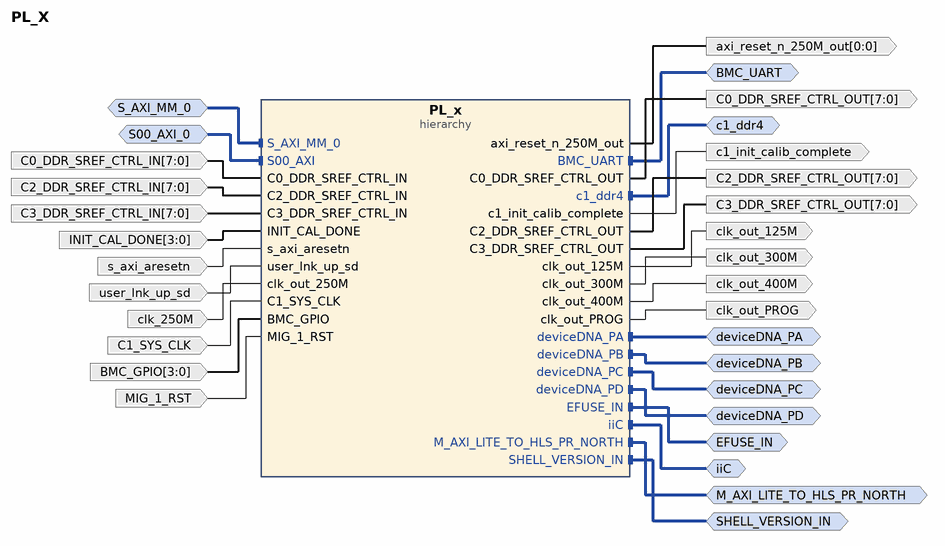
[diagram p0: block diagram of the top level]
# Vivado block design PL_X, xcu200-fsgd2104-2-e, Vivado 2020.1
create_bd_design PL_X

create_bd_intf_port -mode Master -vlnv xilinx.com:interface:gpio_rtl:1.0 EFUSE_IN
create_bd_intf_port -mode Master -vlnv xilinx.com:interface:aximm_rtl:1.0 M_AXI_LITE_TO_HLS_PR_NORTH
set_property -dict [list \
  CONFIG.DATA_WIDTH 32 \
  CONFIG.PROTOCOL AXI4LITE \
  CONFIG.FREQ_HZ 250000000 \
  CONFIG.ADDR_WIDTH 32 \
  CONFIG.HAS_BURST 0 \
  CONFIG.HAS_QOS 0 \
  CONFIG.HAS_REGION 0 \
  CONFIG.NUM_READ_OUTSTANDING 32 \
] [get_bd_intf_ports M_AXI_LITE_TO_HLS_PR_NORTH]
create_bd_intf_port -mode Master -vlnv xilinx.com:interface:gpio_rtl:1.0 SHELL_VERSION_IN
create_bd_intf_port -mode Slave -vlnv xilinx.com:interface:aximm_rtl:1.0 S_AXI_MM_0
set_property -dict [list \
  CONFIG.DATA_WIDTH 512 \
  CONFIG.PROTOCOL AXI4 \
  CONFIG.FREQ_HZ 250000000 \
  CONFIG.ID_WIDTH 6 \
  CONFIG.ADDR_WIDTH 64 \
  CONFIG.AWUSER_WIDTH 0 \
  CONFIG.ARUSER_WIDTH 0 \
  CONFIG.WUSER_WIDTH 0 \
  CONFIG.RUSER_WIDTH 0 \
  CONFIG.BUSER_WIDTH 0 \
  CONFIG.READ_WRITE_MODE READ_WRITE \
  CONFIG.HAS_BURST 1 \
  CONFIG.HAS_LOCK 1 \
  CONFIG.HAS_PROT 1 \
  CONFIG.HAS_CACHE 1 \
  CONFIG.HAS_QOS 1 \
  CONFIG.HAS_REGION 1 \
  CONFIG.HAS_WSTRB 1 \
  CONFIG.HAS_BRESP 1 \
  CONFIG.HAS_RRESP 1 \
  CONFIG.SUPPORTS_NARROW_BURST 0 \
  CONFIG.NUM_READ_OUTSTANDING 32 \
  CONFIG.NUM_WRITE_OUTSTANDING 32 \
  CONFIG.MAX_BURST_LENGTH 256 \
  CONFIG.NUM_READ_THREADS 1 \
  CONFIG.NUM_WRITE_THREADS 1 \
  CONFIG.RUSER_BITS_PER_BYTE 0 \
  CONFIG.WUSER_BITS_PER_BYTE 0 \
] [get_bd_intf_ports S_AXI_MM_0]
create_bd_intf_port -mode Master -vlnv xilinx.com:interface:ddr4_rtl:1.0 c1_ddr4
create_bd_intf_port -mode Master -vlnv xilinx.com:interface:gpio_rtl:1.0 deviceDNA_PA
create_bd_intf_port -mode Master -vlnv xilinx.com:interface:gpio_rtl:1.0 deviceDNA_PB
create_bd_intf_port -mode Master -vlnv xilinx.com:interface:gpio_rtl:1.0 deviceDNA_PC
create_bd_intf_port -mode Master -vlnv xilinx.com:interface:gpio_rtl:1.0 deviceDNA_PD
create_bd_intf_port -mode Slave -vlnv xilinx.com:interface:aximm_rtl:1.0 S00_AXI_0
set_property -dict [list \
  CONFIG.DATA_WIDTH 32 \
  CONFIG.PROTOCOL AXI4LITE \
  CONFIG.FREQ_HZ 250000000 \
  CONFIG.ID_WIDTH 0 \
  CONFIG.ADDR_WIDTH 32 \
  CONFIG.AWUSER_WIDTH 0 \
  CONFIG.ARUSER_WIDTH 0 \
  CONFIG.WUSER_WIDTH 0 \
  CONFIG.RUSER_WIDTH 0 \
  CONFIG.BUSER_WIDTH 0 \
  CONFIG.READ_WRITE_MODE READ_WRITE \
  CONFIG.HAS_BURST 1 \
  CONFIG.HAS_LOCK 1 \
  CONFIG.HAS_PROT 1 \
  CONFIG.HAS_CACHE 1 \
  CONFIG.HAS_QOS 1 \
  CONFIG.HAS_REGION 1 \
  CONFIG.HAS_WSTRB 1 \
  CONFIG.HAS_BRESP 1 \
  CONFIG.HAS_RRESP 1 \
  CONFIG.SUPPORTS_NARROW_BURST 0 \
  CONFIG.NUM_READ_OUTSTANDING 2 \
  CONFIG.NUM_WRITE_OUTSTANDING 2 \
  CONFIG.MAX_BURST_LENGTH 1 \
  CONFIG.NUM_READ_THREADS 1 \
  CONFIG.NUM_WRITE_THREADS 1 \
  CONFIG.RUSER_BITS_PER_BYTE 0 \
  CONFIG.WUSER_BITS_PER_BYTE 0 \
] [get_bd_intf_ports S00_AXI_0]
create_bd_intf_port -mode Master -vlnv xilinx.com:interface:uart_rtl:1.0 BMC_UART
create_bd_intf_port -mode Master -vlnv xilinx.com:interface:iic_rtl:1.0 iiC
create_bd_port -dir I -from 7 -to 0 C0_DDR_SREF_CTRL_IN
create_bd_port -dir O -from 7 -to 0 C0_DDR_SREF_CTRL_OUT
create_bd_port -dir I -from 7 -to 0 C2_DDR_SREF_CTRL_IN
create_bd_port -dir O -from 7 -to 0 C2_DDR_SREF_CTRL_OUT
create_bd_port -dir I -from 7 -to 0 C3_DDR_SREF_CTRL_IN
create_bd_port -dir O -from 7 -to 0 C3_DDR_SREF_CTRL_OUT
create_bd_port -dir I -from 3 -to 0 INIT_CAL_DONE
create_bd_port -dir O -from 0 -to 0 -type rst axi_reset_n_250M_out
create_bd_port -dir O c1_init_calib_complete
create_bd_port -dir O -type clk clk_out_125M
create_bd_port -dir O -type clk clk_out_300M
create_bd_port -dir O -type clk clk_out_400M
create_bd_port -dir O -type clk clk_out_PROG
create_bd_port -dir I -type rst s_axi_aresetn
create_bd_port -dir I user_lnk_up_sd
create_bd_port -dir I -type clk clk_250M
set_property -dict [list \
  CONFIG.ASSOCIATED_BUSIF S00_AXI_0:S_AXI_MM_0:M_AXI_LITE_TO_HLS_PR_NORTH \
  CONFIG.ASSOCIATED_RESET s_axi_aresetn \
  CONFIG.FREQ_HZ 250000000 \
] [get_bd_ports clk_250M]
create_bd_port -dir I -type clk C1_SYS_CLK
set_property -dict {CONFIG.FREQ_HZ 300000000} [get_bd_ports C1_SYS_CLK]
create_bd_port -dir I -from 3 -to 0 -type intr BMC_GPIO
set_property -dict {CONFIG.PortWidth 4} [get_bd_ports BMC_GPIO]
create_bd_port -dir I MIG_1_RST

create_bd_cell -type hier PL_x

# ---- hierarchy /PL_x ----
current_bd_instance /PL_x
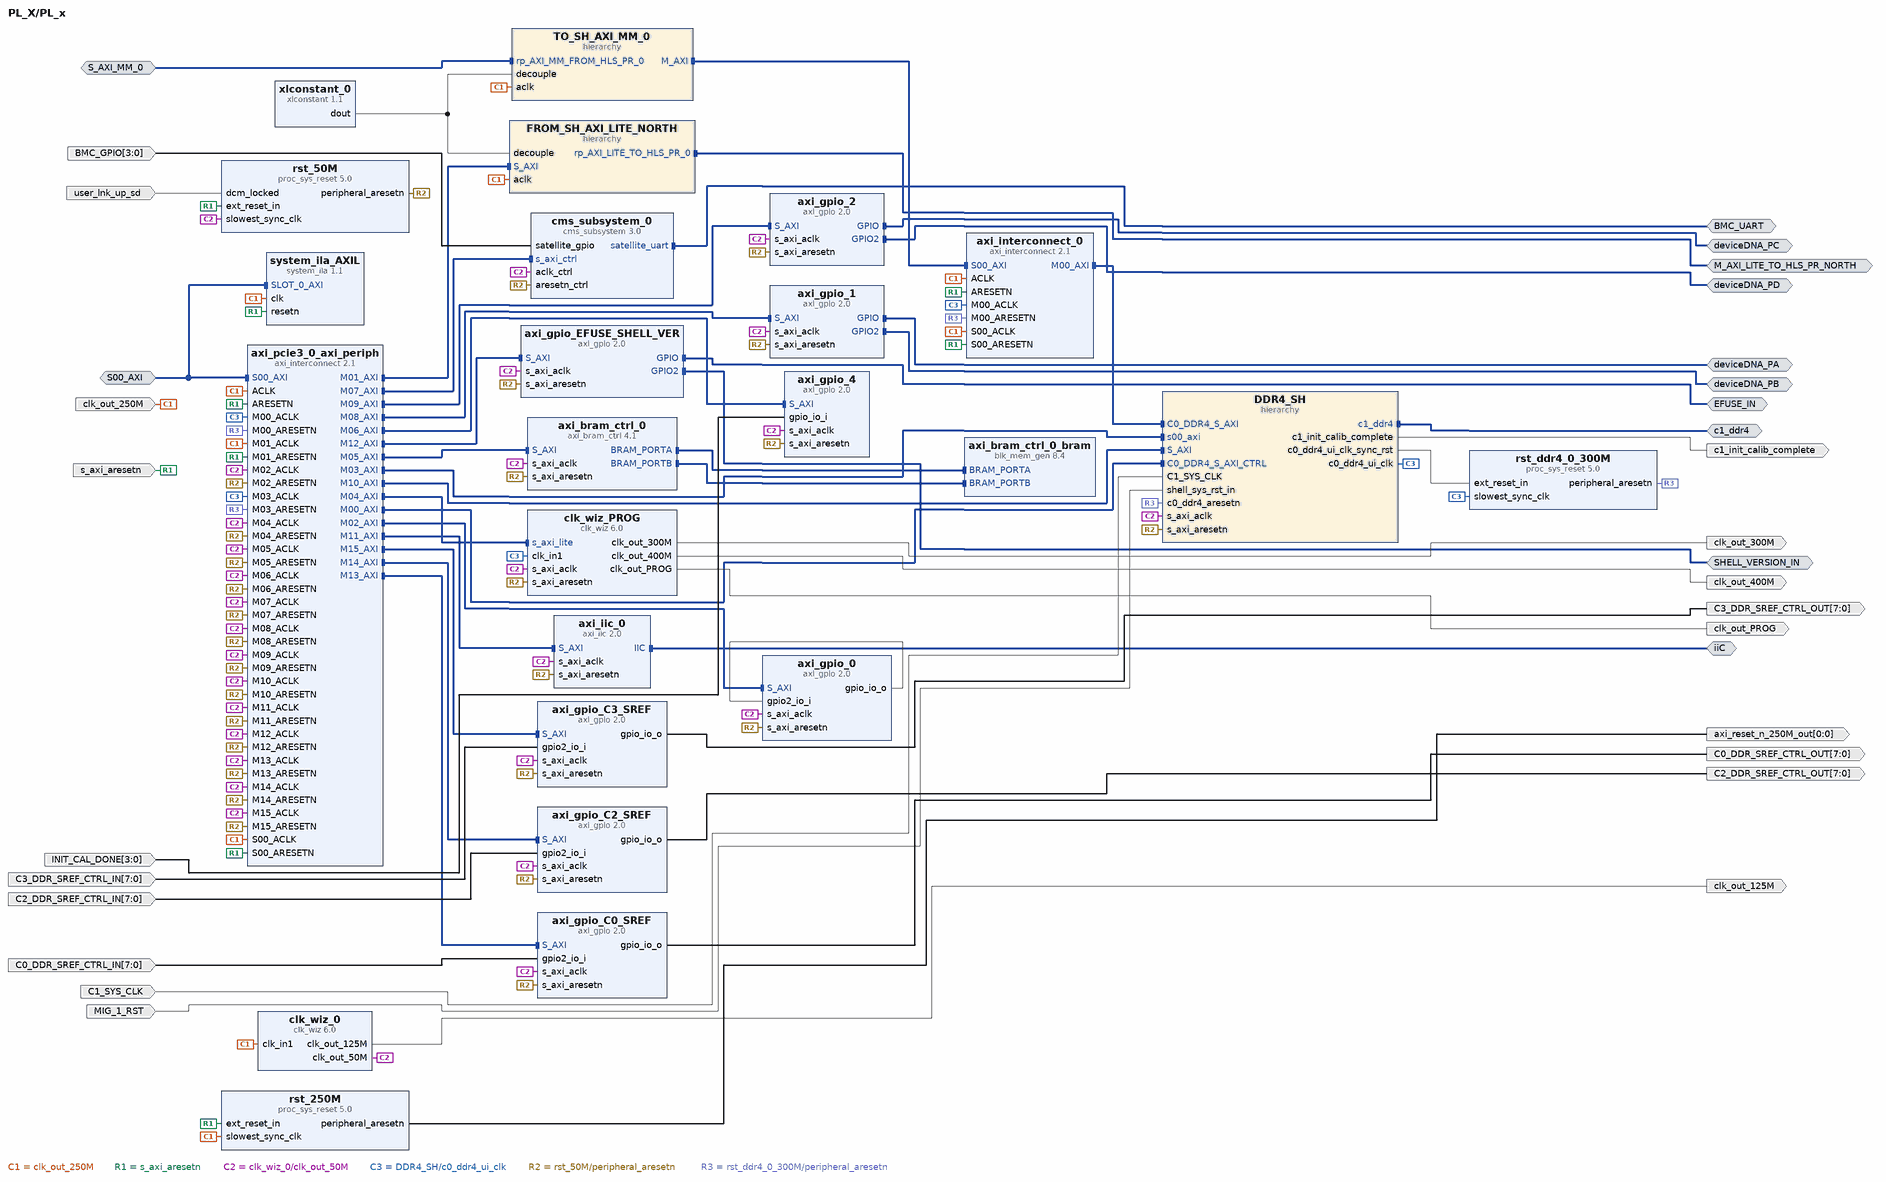
[diagram p1: block diagram inside /PL_x]
create_bd_intf_pin -mode Master -vlnv xilinx.com:interface:gpio_rtl:1.0 EFUSE_IN
create_bd_intf_pin -mode Master -vlnv xilinx.com:interface:aximm_rtl:1.0 M_AXI_LITE_TO_HLS_PR_NORTH
create_bd_intf_pin -mode Master -vlnv xilinx.com:interface:gpio_rtl:1.0 SHELL_VERSION_IN
create_bd_intf_pin -mode Slave -vlnv xilinx.com:interface:aximm_rtl:1.0 S_AXI_MM_0
create_bd_intf_pin -mode Master -vlnv xilinx.com:interface:ddr4_rtl:1.0 c1_ddr4
create_bd_intf_pin -mode Master -vlnv xilinx.com:interface:gpio_rtl:1.0 deviceDNA_PA
create_bd_intf_pin -mode Master -vlnv xilinx.com:interface:gpio_rtl:1.0 deviceDNA_PB
create_bd_intf_pin -mode Master -vlnv xilinx.com:interface:gpio_rtl:1.0 deviceDNA_PC
create_bd_intf_pin -mode Master -vlnv xilinx.com:interface:gpio_rtl:1.0 deviceDNA_PD
create_bd_intf_pin -mode Slave -vlnv xilinx.com:interface:aximm_rtl:1.0 S00_AXI
create_bd_intf_pin -mode Master -vlnv xilinx.com:interface:uart_rtl:1.0 BMC_UART
create_bd_intf_pin -mode Master -vlnv xilinx.com:interface:iic_rtl:1.0 iiC
create_bd_pin -dir I -from 7 -to 0 C0_DDR_SREF_CTRL_IN
create_bd_pin -dir O -from 7 -to 0 C0_DDR_SREF_CTRL_OUT
create_bd_pin -dir I -from 7 -to 0 C2_DDR_SREF_CTRL_IN
create_bd_pin -dir O -from 7 -to 0 C2_DDR_SREF_CTRL_OUT
create_bd_pin -dir I -from 7 -to 0 C3_DDR_SREF_CTRL_IN
create_bd_pin -dir O -from 7 -to 0 C3_DDR_SREF_CTRL_OUT
create_bd_pin -dir I -from 3 -to 0 INIT_CAL_DONE
create_bd_pin -dir O -from 0 -to 0 -type rst axi_reset_n_250M_out
create_bd_pin -dir O c1_init_calib_complete
create_bd_pin -dir O -type clk clk_out_125M
create_bd_pin -dir O -type clk clk_out_300M
create_bd_pin -dir O -type clk clk_out_400M
create_bd_pin -dir O -type clk clk_out_PROG
create_bd_pin -dir I user_lnk_up_sd
create_bd_pin -dir I -type rst s_axi_aresetn
create_bd_pin -dir I -type clk clk_out_250M
create_bd_pin -dir I -type clk C1_SYS_CLK
create_bd_pin -dir I -from 3 -to 0 -type intr BMC_GPIO
create_bd_pin -dir I MIG_1_RST

create_bd_cell -type hier FROM_SH_AXI_LITE_NORTH
create_bd_cell -type hier TO_SH_AXI_MM_0
create_bd_cell -type ip -vlnv xilinx.com:ip:axi_bram_ctrl:4.1 axi_bram_ctrl_0
set_property -dict {CONFIG.PROTOCOL AXI4LITE} [get_bd_cells axi_bram_ctrl_0]
create_bd_cell -type ip -vlnv xilinx.com:ip:blk_mem_gen:8.4 axi_bram_ctrl_0_bram
set_property -dict [list \
  CONFIG.Enable_B Use_ENB_Pin \
  CONFIG.Memory_Type True_Dual_Port_RAM \
  CONFIG.Port_B_Clock 100 \
  CONFIG.Port_B_Enable_Rate 100 \
  CONFIG.Port_B_Write_Rate 50 \
  CONFIG.Use_RSTB_Pin true \
] [get_bd_cells axi_bram_ctrl_0_bram]
create_bd_cell -type ip -vlnv xilinx.com:ip:axi_gpio:2.0 axi_gpio_0
set_property -dict [list \
  CONFIG.C_ALL_INPUTS_2 1 \
  CONFIG.C_ALL_OUTPUTS 1 \
  CONFIG.C_GPIO2_WIDTH 1 \
  CONFIG.C_GPIO_WIDTH 1 \
  CONFIG.C_IS_DUAL 1 \
] [get_bd_cells axi_gpio_0]
create_bd_cell -type ip -vlnv xilinx.com:ip:axi_gpio:2.0 axi_gpio_1
set_property -dict {CONFIG.C_ALL_INPUTS 1 CONFIG.C_ALL_INPUTS_2 1 CONFIG.C_IS_DUAL 1} [get_bd_cells axi_gpio_1]
create_bd_cell -type ip -vlnv xilinx.com:ip:axi_gpio:2.0 axi_gpio_2
set_property -dict {CONFIG.C_ALL_INPUTS 1 CONFIG.C_ALL_INPUTS_2 1 CONFIG.C_IS_DUAL 1} [get_bd_cells axi_gpio_2]
create_bd_cell -type ip -vlnv xilinx.com:ip:axi_gpio:2.0 axi_gpio_4
set_property -dict {CONFIG.C_ALL_INPUTS 1 CONFIG.C_GPIO_WIDTH 4} [get_bd_cells axi_gpio_4]
create_bd_cell -type ip -vlnv xilinx.com:ip:axi_gpio:2.0 axi_gpio_C0_SREF
set_property -dict [list \
  CONFIG.C_ALL_INPUTS 0 \
  CONFIG.C_ALL_INPUTS_2 1 \
  CONFIG.C_ALL_OUTPUTS 1 \
  CONFIG.C_GPIO2_WIDTH 8 \
  CONFIG.C_GPIO_WIDTH 8 \
  CONFIG.C_IS_DUAL 1 \
] [get_bd_cells axi_gpio_C0_SREF]
create_bd_cell -type ip -vlnv xilinx.com:ip:axi_gpio:2.0 axi_gpio_C2_SREF
set_property -dict [list \
  CONFIG.C_ALL_INPUTS 0 \
  CONFIG.C_ALL_INPUTS_2 1 \
  CONFIG.C_ALL_OUTPUTS 1 \
  CONFIG.C_GPIO2_WIDTH 8 \
  CONFIG.C_GPIO_WIDTH 8 \
  CONFIG.C_IS_DUAL 1 \
] [get_bd_cells axi_gpio_C2_SREF]
create_bd_cell -type ip -vlnv xilinx.com:ip:axi_gpio:2.0 axi_gpio_C3_SREF
set_property -dict [list \
  CONFIG.C_ALL_INPUTS 0 \
  CONFIG.C_ALL_INPUTS_2 1 \
  CONFIG.C_ALL_OUTPUTS 1 \
  CONFIG.C_GPIO2_WIDTH 8 \
  CONFIG.C_GPIO_WIDTH 8 \
  CONFIG.C_IS_DUAL 1 \
] [get_bd_cells axi_gpio_C3_SREF]
create_bd_cell -type ip -vlnv xilinx.com:ip:axi_gpio:2.0 axi_gpio_EFUSE_SHELL_VER
set_property -dict {CONFIG.C_ALL_INPUTS 1 CONFIG.C_ALL_INPUTS_2 1 CONFIG.C_IS_DUAL 1} [get_bd_cells axi_gpio_EFUSE_SHELL_VER]
create_bd_cell -type ip -vlnv xilinx.com:ip:axi_interconnect:2.1 axi_interconnect_0
set_property -dict [list \
  CONFIG.M00_HAS_DATA_FIFO 0 \
  CONFIG.M00_HAS_REGSLICE 4 \
  CONFIG.M01_HAS_REGSLICE 4 \
  CONFIG.NUM_MI 1 \
  CONFIG.NUM_SI 1 \
  CONFIG.S00_HAS_DATA_FIFO 0 \
  CONFIG.S00_HAS_REGSLICE 4 \
  CONFIG.S01_HAS_DATA_FIFO 0 \
  CONFIG.S01_HAS_REGSLICE 4 \
  CONFIG.S02_HAS_DATA_FIFO 0 \
  CONFIG.S02_HAS_REGSLICE 4 \
  CONFIG.S03_HAS_DATA_FIFO 0 \
  CONFIG.S03_HAS_REGSLICE 4 \
  CONFIG.SYNCHRONIZATION_STAGES 2 \
] [get_bd_cells axi_interconnect_0]
create_bd_cell -type ip -vlnv xilinx.com:ip:axi_interconnect:2.1 axi_pcie3_0_axi_periph
set_property -dict [list \
  CONFIG.M00_HAS_REGSLICE 0 \
  CONFIG.M01_HAS_REGSLICE 4 \
  CONFIG.M02_HAS_REGSLICE 0 \
  CONFIG.M03_HAS_REGSLICE 0 \
  CONFIG.M04_HAS_REGSLICE 0 \
  CONFIG.M05_HAS_REGSLICE 0 \
  CONFIG.M06_HAS_REGSLICE 0 \
  CONFIG.M07_HAS_REGSLICE 4 \
  CONFIG.NUM_MI 16 \
  CONFIG.S00_HAS_REGSLICE 4 \
  CONFIG.SYNCHRONIZATION_STAGES 2 \
] [get_bd_cells axi_pcie3_0_axi_periph]
create_bd_cell -type ip -vlnv xilinx.com:ip:clk_wiz:6.0 clk_wiz_0
set_property -dict [list \
  CONFIG.CLKIN1_JITTER_PS 40.0 \
  CONFIG.CLKOUT1_DRIVES BUFG \
  CONFIG.CLKOUT1_JITTER 90.793 \
  CONFIG.CLKOUT1_PHASE_ERROR 72.667 \
  CONFIG.CLKOUT1_REQUESTED_OUT_FREQ 125.000 \
  CONFIG.CLKOUT2_DRIVES BUFG \
  CONFIG.CLKOUT2_JITTER 108.355 \
  CONFIG.CLKOUT2_PHASE_ERROR 72.667 \
  CONFIG.CLKOUT2_REQUESTED_OUT_FREQ 50.000 \
  CONFIG.CLKOUT2_USED true \
  CONFIG.CLKOUT3_DRIVES Buffer \
  CONFIG.CLKOUT3_JITTER 79.446 \
  CONFIG.CLKOUT3_PHASE_ERROR 72.667 \
  CONFIG.CLKOUT3_REQUESTED_OUT_FREQ 100.000 \
  CONFIG.CLKOUT3_USED false \
  CONFIG.CLKOUT4_DRIVES Buffer \
  CONFIG.CLKOUT5_DRIVES Buffer \
  CONFIG.CLKOUT6_DRIVES Buffer \
  CONFIG.CLKOUT7_DRIVES Buffer \
  CONFIG.CLK_OUT1_PORT clk_out_125M \
  CONFIG.CLK_OUT2_PORT clk_out_50M \
  CONFIG.CLK_OUT3_PORT clk_out3 \
  CONFIG.FEEDBACK_SOURCE FDBK_AUTO \
  CONFIG.JITTER_SEL Min_O_Jitter \
  CONFIG.MMCM_BANDWIDTH HIGH \
  CONFIG.MMCM_CLKFBOUT_MULT_F 6.000 \
  CONFIG.MMCM_CLKIN1_PERIOD 4.000 \
  CONFIG.MMCM_CLKIN2_PERIOD 10.0 \
  CONFIG.MMCM_CLKOUT0_DIVIDE_F 12.000 \
  CONFIG.MMCM_CLKOUT1_DIVIDE 30 \
  CONFIG.MMCM_CLKOUT2_DIVIDE 1 \
  CONFIG.MMCM_DIVCLK_DIVIDE 1 \
  CONFIG.NUM_OUT_CLKS 2 \
  CONFIG.PHASESHIFT_MODE WAVEFORM \
  CONFIG.PRIM_SOURCE No_buffer \
  CONFIG.SECONDARY_SOURCE Single_ended_clock_capable_pin \
  CONFIG.USE_FREQ_SYNTH true \
  CONFIG.USE_LOCKED false \
  CONFIG.USE_PHASE_ALIGNMENT false \
  CONFIG.USE_RESET false \
] [get_bd_cells clk_wiz_0]
create_bd_cell -type ip -vlnv xilinx.com:ip:clk_wiz:6.0 clk_wiz_PROG
set_property -dict [list \
  CONFIG.CLKIN1_JITTER_PS 33.330000000000005 \
  CONFIG.CLKOUT1_DRIVES Buffer \
  CONFIG.CLKOUT1_JITTER 77.334 \
  CONFIG.CLKOUT1_PHASE_ERROR 77.836 \
  CONFIG.CLKOUT1_REQUESTED_OUT_FREQ 400.000 \
  CONFIG.CLKOUT2_DRIVES Buffer \
  CONFIG.CLKOUT2_JITTER 77.334 \
  CONFIG.CLKOUT2_PHASE_ERROR 77.836 \
  CONFIG.CLKOUT2_REQUESTED_OUT_FREQ 400.000 \
  CONFIG.CLKOUT2_USED true \
  CONFIG.CLKOUT3_DRIVES Buffer \
  CONFIG.CLKOUT3_JITTER 81.814 \
  CONFIG.CLKOUT3_PHASE_ERROR 77.836 \
  CONFIG.CLKOUT3_REQUESTED_OUT_FREQ 300.000 \
  CONFIG.CLKOUT3_USED true \
  CONFIG.CLKOUT4_DRIVES Buffer \
  CONFIG.CLKOUT5_DRIVES Buffer \
  CONFIG.CLKOUT6_DRIVES Buffer \
  CONFIG.CLKOUT7_DRIVES Buffer \
  CONFIG.CLK_OUT1_PORT clk_out_PROG \
  CONFIG.CLK_OUT2_PORT clk_out_400M \
  CONFIG.CLK_OUT3_PORT clk_out_300M \
  CONFIG.JITTER_SEL Min_O_Jitter \
  CONFIG.MMCM_BANDWIDTH HIGH \
  CONFIG.MMCM_CLKFBOUT_MULT_F 4.000 \
  CONFIG.MMCM_CLKIN1_PERIOD 3.333 \
  CONFIG.MMCM_CLKIN2_PERIOD 10.0 \
  CONFIG.MMCM_CLKOUT0_DIVIDE_F 3.000 \
  CONFIG.MMCM_CLKOUT1_DIVIDE 3 \
  CONFIG.MMCM_CLKOUT2_DIVIDE 4 \
  CONFIG.MMCM_DIVCLK_DIVIDE 1 \
  CONFIG.NUM_OUT_CLKS 3 \
  CONFIG.PRIM_SOURCE No_buffer \
  CONFIG.SECONDARY_SOURCE Single_ended_clock_capable_pin \
  CONFIG.USE_DYN_RECONFIG true \
  CONFIG.USE_PHASE_ALIGNMENT false \
] [get_bd_cells clk_wiz_PROG]
create_bd_cell -type ip -vlnv xilinx.com:ip:proc_sys_reset:5.0 rst_250M
create_bd_cell -type ip -vlnv xilinx.com:ip:proc_sys_reset:5.0 rst_50M
create_bd_cell -type ip -vlnv xilinx.com:ip:proc_sys_reset:5.0 rst_ddr4_0_300M
create_bd_cell -type ip -vlnv xilinx.com:ip:system_ila:1.1 system_ila_AXIL
set_property -dict [list \
  CONFIG.C_INPUT_PIPE_STAGES 1 \
  CONFIG.C_MON_TYPE INTERFACE \
  CONFIG.C_SLOT_0_AXI_R_SEL_TRIG 0 \
  CONFIG.C_SLOT_0_AXI_W_SEL_TRIG 0 \
  CONFIG.C_SLOT_0_TXN_CNTR_EN 0 \
] [get_bd_cells system_ila_AXIL]
create_bd_cell -type ip -vlnv xilinx.com:ip:xlconstant:1.1 xlconstant_0
create_bd_cell -type hier DDR4_SH
create_bd_cell -type ip -vlnv xilinx.com:ip:cms_subsystem:3.0 cms_subsystem_0
create_bd_cell -type ip -vlnv xilinx.com:ip:axi_iic:2.0 axi_iic_0

# ---- hierarchy /PL_x/FROM_SH_AXI_LITE_NORTH ----
current_bd_instance /PL_x/FROM_SH_AXI_LITE_NORTH
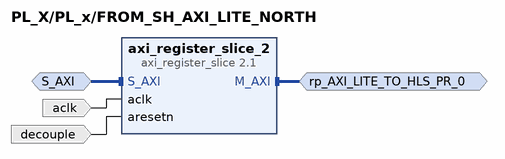
[diagram p2: block diagram inside /PL_x/FROM_SH_AXI_LITE_NORTH]
create_bd_intf_pin -mode Slave -vlnv xilinx.com:interface:aximm_rtl:1.0 S_AXI
create_bd_intf_pin -mode Master -vlnv xilinx.com:interface:aximm_rtl:1.0 rp_AXI_LITE_TO_HLS_PR_0
create_bd_pin -dir I -type clk aclk
create_bd_pin -dir I decouple

create_bd_cell -type ip -vlnv xilinx.com:ip:axi_register_slice:2.1 axi_register_slice_2
set_property -dict [list \
  CONFIG.REG_AR 7 \
  CONFIG.REG_AW 7 \
  CONFIG.REG_B 7 \
  CONFIG.REG_R 7 \
  CONFIG.REG_W 7 \
] [get_bd_cells axi_register_slice_2]

# ---- hierarchy /PL_x/TO_SH_AXI_MM_0 ----
current_bd_instance /PL_x/TO_SH_AXI_MM_0
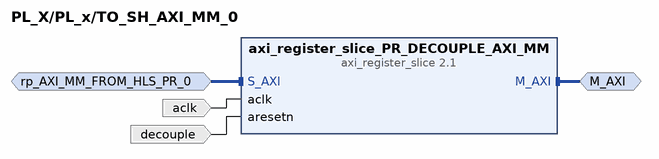
[diagram p3: block diagram inside /PL_x/TO_SH_AXI_MM_0]
create_bd_intf_pin -mode Master -vlnv xilinx.com:interface:aximm_rtl:1.0 M_AXI
create_bd_intf_pin -mode Slave -vlnv xilinx.com:interface:aximm_rtl:1.0 rp_AXI_MM_FROM_HLS_PR_0
create_bd_pin -dir I -type clk aclk
create_bd_pin -dir I decouple

create_bd_cell -type ip -vlnv xilinx.com:ip:axi_register_slice:2.1 axi_register_slice_PR_DECOUPLE_AXI_MM
set_property -dict {CONFIG.REG_AR 7 CONFIG.REG_AW 7 CONFIG.REG_B 7} [get_bd_cells axi_register_slice_PR_DECOUPLE_AXI_MM]

# ---- hierarchy /PL_x/DDR4_SH ----
current_bd_instance /PL_x/DDR4_SH
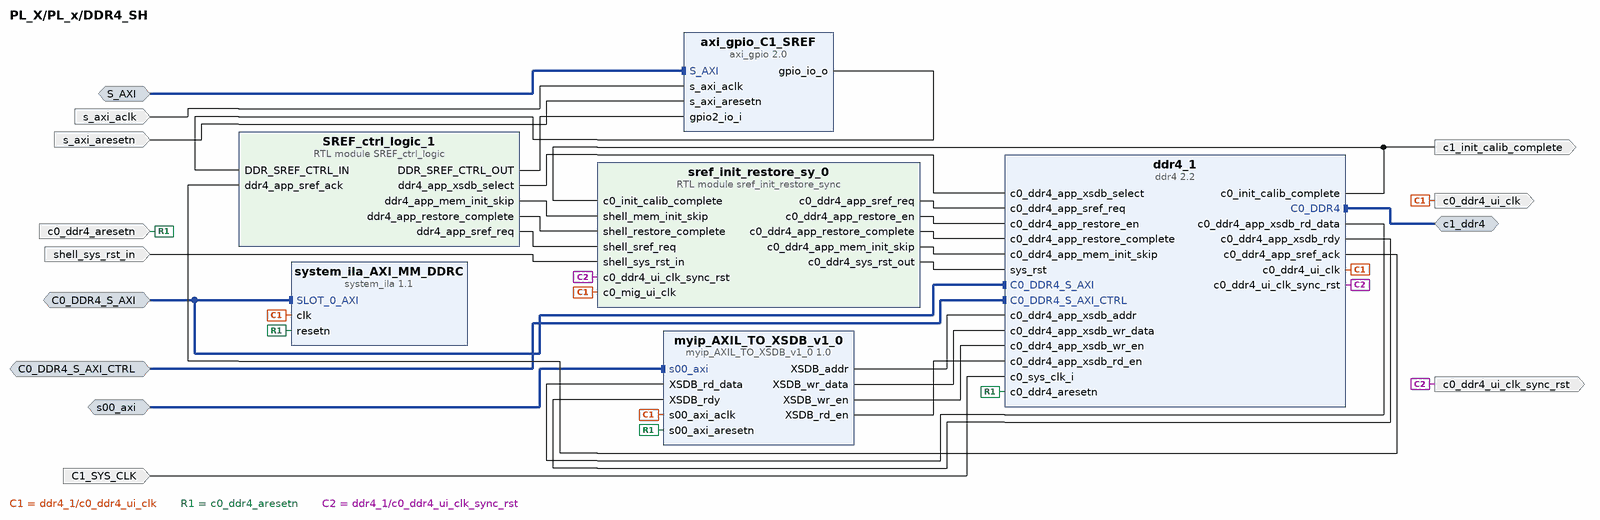
[diagram p4: block diagram inside /PL_x/DDR4_SH]
create_bd_intf_pin -mode Slave -vlnv xilinx.com:interface:aximm_rtl:1.0 s00_axi
create_bd_intf_pin -mode Slave -vlnv xilinx.com:interface:aximm_rtl:1.0 S_AXI
create_bd_intf_pin -mode Master -vlnv xilinx.com:interface:ddr4_rtl:1.0 c1_ddr4
create_bd_intf_pin -mode Slave -vlnv xilinx.com:interface:aximm_rtl:1.0 C0_DDR4_S_AXI_CTRL
create_bd_intf_pin -mode Slave -vlnv xilinx.com:interface:aximm_rtl:1.0 C0_DDR4_S_AXI
create_bd_pin -dir O -type clk c0_ddr4_ui_clk
create_bd_pin -dir I -type rst c0_ddr4_aresetn
create_bd_pin -dir I -type clk s_axi_aclk
create_bd_pin -dir I -type rst s_axi_aresetn
create_bd_pin -dir O c1_init_calib_complete
create_bd_pin -dir O -type rst c0_ddr4_ui_clk_sync_rst
create_bd_pin -dir I shell_sys_rst_in
create_bd_pin -dir I -type clk C1_SYS_CLK

create_bd_cell -type ip -vlnv user.org:user:myip_AXIL_TO_XSDB_v1_0:1.0 myip_AXIL_TO_XSDB_v1_0
create_bd_cell -type ip -vlnv xilinx.com:ip:axi_gpio:2.0 axi_gpio_C1_SREF
set_property -dict [list \
  CONFIG.C_ALL_INPUTS 0 \
  CONFIG.C_ALL_INPUTS_2 1 \
  CONFIG.C_ALL_OUTPUTS 1 \
  CONFIG.C_GPIO2_WIDTH 8 \
  CONFIG.C_GPIO_WIDTH 8 \
  CONFIG.C_IS_DUAL 1 \
] [get_bd_cells axi_gpio_C1_SREF]
create_bd_cell -type module -reference SREF_ctrl_logic SREF_ctrl_logic_1
create_bd_cell -type ip -vlnv xilinx.com:ip:ddr4:2.2 ddr4_1
set_property -dict [list \
  CONFIG.ADDN_UI_CLKOUT1_FREQ_HZ 250 \
  CONFIG.C0.BANK_GROUP_WIDTH 2 \
  CONFIG.C0.CKE_WIDTH 1 \
  CONFIG.C0.CS_WIDTH 1 \
  CONFIG.C0.DDR4_AUTO_AP_COL_A3 true \
  CONFIG.C0.DDR4_AxiAddressWidth 34 \
  CONFIG.C0.DDR4_AxiDataWidth 512 \
  CONFIG.C0.DDR4_CasLatency 17 \
  CONFIG.C0.DDR4_CasWriteLatency 12 \
  CONFIG.C0.DDR4_DataWidth 72 \
  CONFIG.C0.DDR4_InputClockPeriod 3332 \
  CONFIG.C0.DDR4_Mem_Add_Map ROW_COLUMN_BANK \
  CONFIG.C0.DDR4_MemoryPart MTA18ASF2G72PZ-2G3 \
  CONFIG.C0.DDR4_MemoryType RDIMMs \
  CONFIG.C0.DDR4_SELF_REFRESH true \
  CONFIG.C0.DDR4_TimePeriod 833 \
  CONFIG.C0.ODT_WIDTH 1 \
  CONFIG.System_Clock No_Buffer \
] [get_bd_cells ddr4_1]
create_bd_cell -type module -reference sref_init_restore_sync sref_init_restore_sy_0
create_bd_cell -type ip -vlnv xilinx.com:ip:system_ila:1.1 system_ila_AXI_MM_DDRC
set_property -dict [list \
  CONFIG.C_SLOT_0_AXI_R_SEL_TRIG 0 \
  CONFIG.C_SLOT_0_AXI_W_SEL_TRIG 0 \
  CONFIG.C_SLOT_0_TXN_CNTR_EN 0 \
] [get_bd_cells system_ila_AXI_MM_DDRC]

# ---- connections ----

current_bd_instance /PL_x
connect_bd_intf_net [get_bd_intf_pins axi_pcie3_0_axi_periph/M04_AXI] [get_bd_intf_pins clk_wiz_PROG/s_axi_lite]
connect_bd_intf_net [get_bd_intf_pins axi_gpio_4/S_AXI] [get_bd_intf_pins axi_pcie3_0_axi_periph/M06_AXI]
connect_bd_intf_net [get_bd_intf_pins DDR4_SH/s00_axi] [get_bd_intf_pins axi_pcie3_0_axi_periph/M03_AXI]
connect_bd_intf_net [get_bd_intf_pins axi_gpio_C0_SREF/S_AXI] [get_bd_intf_pins axi_pcie3_0_axi_periph/M13_AXI]
connect_bd_intf_net [get_bd_intf_pins DDR4_SH/S_AXI] [get_bd_intf_pins axi_pcie3_0_axi_periph/M10_AXI]
connect_bd_intf_net [get_bd_intf_pins axi_gpio_C3_SREF/S_AXI] [get_bd_intf_pins axi_pcie3_0_axi_periph/M15_AXI]
connect_bd_intf_net [get_bd_intf_pins cms_subsystem_0/s_axi_ctrl] [get_bd_intf_pins axi_pcie3_0_axi_periph/M07_AXI]
connect_bd_intf_net [get_bd_intf_pins axi_gpio_1/S_AXI] [get_bd_intf_pins axi_pcie3_0_axi_periph/M08_AXI]
connect_bd_intf_net [get_bd_intf_pins axi_gpio_2/S_AXI] [get_bd_intf_pins axi_pcie3_0_axi_periph/M09_AXI]
connect_bd_intf_net [get_bd_intf_pins axi_gpio_EFUSE_SHELL_VER/S_AXI] [get_bd_intf_pins axi_pcie3_0_axi_periph/M12_AXI]
connect_bd_intf_net [get_bd_intf_pins EFUSE_IN] [get_bd_intf_pins axi_gpio_EFUSE_SHELL_VER/GPIO]
connect_bd_intf_net [get_bd_intf_pins axi_interconnect_0/M00_AXI] [get_bd_intf_pins DDR4_SH/C0_DDR4_S_AXI]
connect_bd_intf_net [get_bd_intf_pins axi_gpio_0/S_AXI] [get_bd_intf_pins axi_pcie3_0_axi_periph/M02_AXI]
connect_bd_intf_net [get_bd_intf_pins axi_pcie3_0_axi_periph/M00_AXI] [get_bd_intf_pins DDR4_SH/C0_DDR4_S_AXI_CTRL]
connect_bd_intf_net [get_bd_intf_pins FROM_SH_AXI_LITE_NORTH/S_AXI] [get_bd_intf_pins axi_pcie3_0_axi_periph/M01_AXI]
connect_bd_intf_net [get_bd_intf_pins SHELL_VERSION_IN] [get_bd_intf_pins axi_gpio_EFUSE_SHELL_VER/GPIO2]
connect_bd_intf_net [get_bd_intf_pins axi_bram_ctrl_0/BRAM_PORTA] [get_bd_intf_pins axi_bram_ctrl_0_bram/BRAM_PORTA]
connect_bd_intf_net [get_bd_intf_pins S00_AXI] [get_bd_intf_pins axi_pcie3_0_axi_periph/S00_AXI]
connect_bd_intf_net [get_bd_intf_pins S00_AXI] [get_bd_intf_pins system_ila_AXIL/SLOT_0_AXI]
connect_bd_intf_net [get_bd_intf_pins axi_bram_ctrl_0/S_AXI] [get_bd_intf_pins axi_pcie3_0_axi_periph/M05_AXI]
connect_bd_intf_net [get_bd_intf_pins axi_gpio_C2_SREF/S_AXI] [get_bd_intf_pins axi_pcie3_0_axi_periph/M14_AXI]
connect_bd_intf_net -intf_net ddr4_0_C0_DDR4 [get_bd_intf_pins c1_ddr4] [get_bd_intf_pins DDR4_SH/c1_ddr4]
connect_bd_intf_net -intf_net S_AXI_MM_0_1 [get_bd_intf_pins S_AXI_MM_0] [get_bd_intf_pins TO_SH_AXI_MM_0/rp_AXI_MM_FROM_HLS_PR_0]
connect_bd_intf_net -intf_net FROM_SH_AXI_LITE_rp_AXI_LITE_TO_HLS_PR_0 [get_bd_intf_pins M_AXI_LITE_TO_HLS_PR_NORTH] [get_bd_intf_pins FROM_SH_AXI_LITE_NORTH/rp_AXI_LITE_TO_HLS_PR_0]
connect_bd_intf_net [get_bd_intf_pins TO_SH_AXI_MM_0/M_AXI] [get_bd_intf_pins axi_interconnect_0/S00_AXI]
connect_bd_intf_net [get_bd_intf_pins axi_bram_ctrl_0/BRAM_PORTB] [get_bd_intf_pins axi_bram_ctrl_0_bram/BRAM_PORTB]
connect_bd_intf_net [get_bd_intf_pins deviceDNA_PA] [get_bd_intf_pins axi_gpio_1/GPIO]
connect_bd_intf_net [get_bd_intf_pins deviceDNA_PB] [get_bd_intf_pins axi_gpio_1/GPIO2]
connect_bd_intf_net [get_bd_intf_pins deviceDNA_PC] [get_bd_intf_pins axi_gpio_2/GPIO]
connect_bd_intf_net [get_bd_intf_pins deviceDNA_PD] [get_bd_intf_pins axi_gpio_2/GPIO2]
connect_bd_intf_net [get_bd_intf_pins BMC_UART] [get_bd_intf_pins cms_subsystem_0/satellite_uart]
connect_bd_intf_net [get_bd_intf_pins iiC] [get_bd_intf_pins axi_iic_0/IIC]
connect_bd_intf_net [get_bd_intf_pins axi_pcie3_0_axi_periph/M11_AXI] [get_bd_intf_pins axi_iic_0/S_AXI]
connect_bd_net -net C1_SYS_CLK [get_bd_pins C0_DDR_SREF_CTRL_IN] [get_bd_pins axi_gpio_C0_SREF/gpio2_io_i]
connect_bd_net -net THIN_SHELL_user_lnk_up [get_bd_pins user_lnk_up_sd] [get_bd_pins rst_50M/dcm_locked]
connect_bd_net -net axi_gpio_3_gpio_io_o [get_bd_pins axi_gpio_C2_SREF/gpio_io_o] [get_bd_pins C2_DDR_SREF_CTRL_OUT]
connect_bd_net [get_bd_pins axi_gpio_C0_SREF/gpio_io_o] [get_bd_pins C0_DDR_SREF_CTRL_OUT]
connect_bd_net [get_bd_pins axi_gpio_C3_SREF/gpio_io_o] [get_bd_pins C3_DDR_SREF_CTRL_OUT]
connect_bd_net -net axi_pcie3_0_axi_aclk [get_bd_pins clk_out_250M] \
  [get_bd_pins FROM_SH_AXI_LITE_NORTH/aclk] [get_bd_pins TO_SH_AXI_MM_0/aclk] [get_bd_pins axi_interconnect_0/ACLK] \
  [get_bd_pins axi_interconnect_0/S00_ACLK] [get_bd_pins axi_pcie3_0_axi_periph/ACLK] \
  [get_bd_pins axi_pcie3_0_axi_periph/M01_ACLK] [get_bd_pins axi_pcie3_0_axi_periph/S00_ACLK] \
  [get_bd_pins rst_250M/slowest_sync_clk] [get_bd_pins system_ila_AXIL/clk] [get_bd_pins clk_wiz_0/clk_in1]
connect_bd_net -net axi_pcie3_0_axi_aresetn [get_bd_pins s_axi_aresetn] \
  [get_bd_pins axi_interconnect_0/ARESETN] [get_bd_pins axi_interconnect_0/S00_ARESETN] \
  [get_bd_pins axi_pcie3_0_axi_periph/ARESETN] [get_bd_pins axi_pcie3_0_axi_periph/M01_ARESETN] \
  [get_bd_pins axi_pcie3_0_axi_periph/S00_ARESETN] [get_bd_pins rst_250M/ext_reset_in] [get_bd_pins rst_50M/ext_reset_in] \
  [get_bd_pins system_ila_AXIL/resetn]
connect_bd_net [get_bd_pins clk_wiz_0/clk_out_125M] [get_bd_pins clk_out_125M]
connect_bd_net [get_bd_pins clk_wiz_0/clk_out_50M] \
  [get_bd_pins axi_bram_ctrl_0/s_axi_aclk] [get_bd_pins axi_gpio_0/s_axi_aclk] [get_bd_pins axi_gpio_1/s_axi_aclk] \
  [get_bd_pins axi_gpio_2/s_axi_aclk] [get_bd_pins axi_gpio_4/s_axi_aclk] [get_bd_pins axi_gpio_C0_SREF/s_axi_aclk] \
  [get_bd_pins axi_gpio_C2_SREF/s_axi_aclk] [get_bd_pins axi_gpio_C3_SREF/s_axi_aclk] \
  [get_bd_pins axi_gpio_EFUSE_SHELL_VER/s_axi_aclk] [get_bd_pins axi_pcie3_0_axi_periph/M02_ACLK] \
  [get_bd_pins axi_pcie3_0_axi_periph/M04_ACLK] [get_bd_pins axi_pcie3_0_axi_periph/M05_ACLK] \
  [get_bd_pins axi_pcie3_0_axi_periph/M06_ACLK] [get_bd_pins axi_pcie3_0_axi_periph/M08_ACLK] \
  [get_bd_pins axi_pcie3_0_axi_periph/M09_ACLK] [get_bd_pins axi_pcie3_0_axi_periph/M10_ACLK] \
  [get_bd_pins axi_pcie3_0_axi_periph/M11_ACLK] [get_bd_pins axi_pcie3_0_axi_periph/M12_ACLK] \
  [get_bd_pins axi_pcie3_0_axi_periph/M13_ACLK] [get_bd_pins axi_pcie3_0_axi_periph/M14_ACLK] \
  [get_bd_pins axi_pcie3_0_axi_periph/M15_ACLK] [get_bd_pins clk_wiz_PROG/s_axi_aclk] [get_bd_pins rst_50M/slowest_sync_clk] \
  [get_bd_pins DDR4_SH/s_axi_aclk] [get_bd_pins cms_subsystem_0/aclk_ctrl] [get_bd_pins axi_iic_0/s_axi_aclk] \
  [get_bd_pins axi_pcie3_0_axi_periph/M07_ACLK]
connect_bd_net [get_bd_pins clk_wiz_PROG/clk_out_300M] [get_bd_pins clk_out_300M]
connect_bd_net [get_bd_pins clk_wiz_PROG/clk_out_400M] [get_bd_pins clk_out_400M]
connect_bd_net [get_bd_pins clk_wiz_PROG/clk_out_PROG] [get_bd_pins clk_out_PROG]
connect_bd_net -net ddr4_0_c0_ddr4_ui_clk [get_bd_pins DDR4_SH/c0_ddr4_ui_clk] \
  [get_bd_pins axi_interconnect_0/M00_ACLK] [get_bd_pins axi_pcie3_0_axi_periph/M00_ACLK] [get_bd_pins clk_wiz_PROG/clk_in1] \
  [get_bd_pins rst_ddr4_0_300M/slowest_sync_clk] [get_bd_pins axi_pcie3_0_axi_periph/M03_ACLK]
connect_bd_net -net ddr4_0_c0_ddr4_ui_clk_sync_rst [get_bd_pins DDR4_SH/c0_ddr4_ui_clk_sync_rst] [get_bd_pins rst_ddr4_0_300M/ext_reset_in]
connect_bd_net -net ddr4_1_c0_init_calib_complete [get_bd_pins DDR4_SH/c1_init_calib_complete] [get_bd_pins c1_init_calib_complete]
connect_bd_net -net gpio2_io_i_0_1 [get_bd_pins C2_DDR_SREF_CTRL_IN] [get_bd_pins axi_gpio_C2_SREF/gpio2_io_i]
connect_bd_net -net gpio2_io_i_0_2 [get_bd_pins C3_DDR_SREF_CTRL_IN] [get_bd_pins axi_gpio_C3_SREF/gpio2_io_i]
connect_bd_net -net gpio_io_i_0_1 [get_bd_pins INIT_CAL_DONE] [get_bd_pins axi_gpio_4/gpio_io_i]
connect_bd_net [get_bd_pins rst_250M/peripheral_aresetn] [get_bd_pins axi_reset_n_250M_out]
connect_bd_net -net rst_ddr4_0_300M1_peripheral_aresetn [get_bd_pins rst_50M/peripheral_aresetn] \
  [get_bd_pins axi_bram_ctrl_0/s_axi_aresetn] [get_bd_pins axi_gpio_0/s_axi_aresetn] [get_bd_pins axi_gpio_1/s_axi_aresetn] \
  [get_bd_pins axi_gpio_2/s_axi_aresetn] [get_bd_pins axi_gpio_4/s_axi_aresetn] [get_bd_pins axi_gpio_C0_SREF/s_axi_aresetn] \
  [get_bd_pins axi_gpio_C2_SREF/s_axi_aresetn] [get_bd_pins axi_gpio_C3_SREF/s_axi_aresetn] \
  [get_bd_pins axi_gpio_EFUSE_SHELL_VER/s_axi_aresetn] [get_bd_pins axi_pcie3_0_axi_periph/M02_ARESETN] \
  [get_bd_pins axi_pcie3_0_axi_periph/M04_ARESETN] [get_bd_pins axi_pcie3_0_axi_periph/M05_ARESETN] \
  [get_bd_pins axi_pcie3_0_axi_periph/M06_ARESETN] [get_bd_pins axi_pcie3_0_axi_periph/M08_ARESETN] \
  [get_bd_pins axi_pcie3_0_axi_periph/M09_ARESETN] [get_bd_pins axi_pcie3_0_axi_periph/M10_ARESETN] \
  [get_bd_pins axi_pcie3_0_axi_periph/M11_ARESETN] [get_bd_pins axi_pcie3_0_axi_periph/M12_ARESETN] \
  [get_bd_pins axi_pcie3_0_axi_periph/M13_ARESETN] [get_bd_pins axi_pcie3_0_axi_periph/M14_ARESETN] \
  [get_bd_pins axi_pcie3_0_axi_periph/M15_ARESETN] [get_bd_pins clk_wiz_PROG/s_axi_aresetn] \
  [get_bd_pins DDR4_SH/s_axi_aresetn] [get_bd_pins cms_subsystem_0/aresetn_ctrl] [get_bd_pins axi_iic_0/s_axi_aresetn] \
  [get_bd_pins axi_pcie3_0_axi_periph/M07_ARESETN]
connect_bd_net [get_bd_pins rst_ddr4_0_300M/peripheral_aresetn] \
  [get_bd_pins axi_interconnect_0/M00_ARESETN] [get_bd_pins axi_pcie3_0_axi_periph/M00_ARESETN] \
  [get_bd_pins DDR4_SH/c0_ddr4_aresetn] [get_bd_pins axi_pcie3_0_axi_periph/M03_ARESETN]
connect_bd_net -net xlslice_0_Dout [get_bd_pins axi_gpio_0/gpio_io_o] [get_bd_pins axi_gpio_0/gpio2_io_i]
connect_bd_net [get_bd_pins xlconstant_0/dout] [get_bd_pins TO_SH_AXI_MM_0/decouple] [get_bd_pins FROM_SH_AXI_LITE_NORTH/decouple]
connect_bd_net [get_bd_pins C1_SYS_CLK] [get_bd_pins DDR4_SH/C1_SYS_CLK]
connect_bd_net [get_bd_pins BMC_GPIO] [get_bd_pins cms_subsystem_0/satellite_gpio]
connect_bd_net [get_bd_pins MIG_1_RST] [get_bd_pins DDR4_SH/shell_sys_rst_in]

current_bd_instance /PL_x/FROM_SH_AXI_LITE_NORTH
connect_bd_intf_net [get_bd_intf_pins S_AXI] [get_bd_intf_pins axi_register_slice_2/S_AXI]
connect_bd_intf_net [get_bd_intf_pins rp_AXI_LITE_TO_HLS_PR_0] [get_bd_intf_pins axi_register_slice_2/M_AXI]
connect_bd_net -net clk_wiz_0_clk_out_125M [get_bd_pins aclk] [get_bd_pins axi_register_slice_2/aclk]
connect_bd_net [get_bd_pins decouple] [get_bd_pins axi_register_slice_2/aresetn]

current_bd_instance /PL_x/TO_SH_AXI_MM_0
connect_bd_intf_net [get_bd_intf_pins M_AXI] [get_bd_intf_pins axi_register_slice_PR_DECOUPLE_AXI_MM/M_AXI]
connect_bd_intf_net -intf_net rp_AXI_MM_FROM_HLS_PR_0_1 [get_bd_intf_pins rp_AXI_MM_FROM_HLS_PR_0] [get_bd_intf_pins axi_register_slice_PR_DECOUPLE_AXI_MM/S_AXI]
connect_bd_net -net clk_wiz_0_clk_out_125M [get_bd_pins aclk] [get_bd_pins axi_register_slice_PR_DECOUPLE_AXI_MM/aclk]
connect_bd_net [get_bd_pins decouple] [get_bd_pins axi_register_slice_PR_DECOUPLE_AXI_MM/aresetn]

current_bd_instance /PL_x/DDR4_SH
connect_bd_intf_net [get_bd_intf_pins S_AXI] [get_bd_intf_pins axi_gpio_C1_SREF/S_AXI]
connect_bd_intf_net [get_bd_intf_pins s00_axi] [get_bd_intf_pins myip_AXIL_TO_XSDB_v1_0/s00_axi]
connect_bd_intf_net -intf_net ddr4_0_C0_DDR4 [get_bd_intf_pins c1_ddr4] [get_bd_intf_pins ddr4_1/C0_DDR4]
connect_bd_intf_net [get_bd_intf_pins C0_DDR4_S_AXI_CTRL] [get_bd_intf_pins ddr4_1/C0_DDR4_S_AXI_CTRL]
connect_bd_intf_net -intf_net axi_interconnect_0_M00_AXI [get_bd_intf_pins C0_DDR4_S_AXI] [get_bd_intf_pins ddr4_1/C0_DDR4_S_AXI]
connect_bd_intf_net [get_bd_intf_pins C0_DDR4_S_AXI] [get_bd_intf_pins system_ila_AXI_MM_DDRC/SLOT_0_AXI]
connect_bd_net [get_bd_pins myip_AXIL_TO_XSDB_v1_0/XSDB_addr] [get_bd_pins ddr4_1/c0_ddr4_app_xsdb_addr]
connect_bd_net [get_bd_pins myip_AXIL_TO_XSDB_v1_0/XSDB_wr_data] [get_bd_pins ddr4_1/c0_ddr4_app_xsdb_wr_data]
connect_bd_net [get_bd_pins myip_AXIL_TO_XSDB_v1_0/XSDB_wr_en] [get_bd_pins ddr4_1/c0_ddr4_app_xsdb_wr_en]
connect_bd_net [get_bd_pins ddr4_1/c0_ddr4_app_xsdb_rd_data] [get_bd_pins myip_AXIL_TO_XSDB_v1_0/XSDB_rd_data]
connect_bd_net [get_bd_pins myip_AXIL_TO_XSDB_v1_0/XSDB_rd_en] [get_bd_pins ddr4_1/c0_ddr4_app_xsdb_rd_en]
connect_bd_net [get_bd_pins ddr4_1/c0_ddr4_app_xsdb_rdy] [get_bd_pins myip_AXIL_TO_XSDB_v1_0/XSDB_rdy]
connect_bd_net [get_bd_pins axi_gpio_C1_SREF/gpio_io_o] [get_bd_pins SREF_ctrl_logic_1/DDR_SREF_CTRL_IN]
connect_bd_net [get_bd_pins SREF_ctrl_logic_1/DDR_SREF_CTRL_OUT] [get_bd_pins axi_gpio_C1_SREF/gpio2_io_i]
connect_bd_net [get_bd_pins ddr4_1/c0_ddr4_app_sref_ack] [get_bd_pins SREF_ctrl_logic_1/ddr4_app_sref_ack]
connect_bd_net [get_bd_pins SREF_ctrl_logic_1/ddr4_app_xsdb_select] [get_bd_pins ddr4_1/c0_ddr4_app_xsdb_select]
connect_bd_net [get_bd_pins SREF_ctrl_logic_1/ddr4_app_mem_init_skip] [get_bd_pins sref_init_restore_sy_0/shell_mem_init_skip]
connect_bd_net [get_bd_pins SREF_ctrl_logic_1/ddr4_app_restore_complete] [get_bd_pins sref_init_restore_sy_0/shell_restore_complete]
connect_bd_net [get_bd_pins SREF_ctrl_logic_1/ddr4_app_sref_req] [get_bd_pins sref_init_restore_sy_0/shell_sref_req]
connect_bd_net [get_bd_pins sref_init_restore_sy_0/c0_ddr4_app_sref_req] [get_bd_pins ddr4_1/c0_ddr4_app_sref_req]
connect_bd_net [get_bd_pins sref_init_restore_sy_0/c0_ddr4_app_restore_en] [get_bd_pins ddr4_1/c0_ddr4_app_restore_en]
connect_bd_net [get_bd_pins sref_init_restore_sy_0/c0_ddr4_app_restore_complete] [get_bd_pins ddr4_1/c0_ddr4_app_restore_complete]
connect_bd_net [get_bd_pins sref_init_restore_sy_0/c0_ddr4_app_mem_init_skip] [get_bd_pins ddr4_1/c0_ddr4_app_mem_init_skip]
connect_bd_net [get_bd_pins sref_init_restore_sy_0/c0_ddr4_sys_rst_out] [get_bd_pins ddr4_1/sys_rst]
connect_bd_net -net ddr4_0_c0_ddr4_ui_clk [get_bd_pins ddr4_1/c0_ddr4_ui_clk] \
  [get_bd_pins c0_ddr4_ui_clk] [get_bd_pins sref_init_restore_sy_0/c0_mig_ui_clk] \
  [get_bd_pins myip_AXIL_TO_XSDB_v1_0/s00_axi_aclk] [get_bd_pins system_ila_AXI_MM_DDRC/clk]
connect_bd_net -net rst_ddr4_0_300M_peripheral_aresetn [get_bd_pins c0_ddr4_aresetn] \
  [get_bd_pins ddr4_1/c0_ddr4_aresetn] [get_bd_pins myip_AXIL_TO_XSDB_v1_0/s00_axi_aresetn] \
  [get_bd_pins system_ila_AXI_MM_DDRC/resetn]
connect_bd_net -net clk_wiz_0_clk_out_50M [get_bd_pins s_axi_aclk] [get_bd_pins axi_gpio_C1_SREF/s_axi_aclk]
connect_bd_net -net rst_ddr4_0_300M1_peripheral_aresetn [get_bd_pins s_axi_aresetn] [get_bd_pins axi_gpio_C1_SREF/s_axi_aresetn]
connect_bd_net [get_bd_pins ddr4_1/c0_init_calib_complete] \
  [get_bd_pins c1_init_calib_complete] [get_bd_pins sref_init_restore_sy_0/c0_init_calib_complete]
connect_bd_net -net ddr4_0_c0_ddr4_ui_clk_sync_rst [get_bd_pins ddr4_1/c0_ddr4_ui_clk_sync_rst] \
  [get_bd_pins c0_ddr4_ui_clk_sync_rst] [get_bd_pins sref_init_restore_sy_0/c0_ddr4_ui_clk_sync_rst]
connect_bd_net -net util_vector_logic_0_Res [get_bd_pins shell_sys_rst_in] [get_bd_pins sref_init_restore_sy_0/shell_sys_rst_in]
connect_bd_net [get_bd_pins C1_SYS_CLK] [get_bd_pins ddr4_1/c0_sys_clk_i]

current_bd_instance /
connect_bd_intf_net [get_bd_intf_ports EFUSE_IN] [get_bd_intf_pins PL_x/EFUSE_IN]
connect_bd_intf_net [get_bd_intf_ports M_AXI_LITE_TO_HLS_PR_NORTH] [get_bd_intf_pins PL_x/M_AXI_LITE_TO_HLS_PR_NORTH]
connect_bd_intf_net [get_bd_intf_ports SHELL_VERSION_IN] [get_bd_intf_pins PL_x/SHELL_VERSION_IN]
connect_bd_intf_net [get_bd_intf_ports c1_ddr4] [get_bd_intf_pins PL_x/c1_ddr4]
connect_bd_intf_net [get_bd_intf_ports deviceDNA_PA] [get_bd_intf_pins PL_x/deviceDNA_PA]
connect_bd_intf_net [get_bd_intf_ports deviceDNA_PB] [get_bd_intf_pins PL_x/deviceDNA_PB]
connect_bd_intf_net [get_bd_intf_ports deviceDNA_PC] [get_bd_intf_pins PL_x/deviceDNA_PC]
connect_bd_intf_net [get_bd_intf_ports deviceDNA_PD] [get_bd_intf_pins PL_x/deviceDNA_PD]
connect_bd_intf_net -intf_net S_AXI_MM_0_1 [get_bd_intf_ports S_AXI_MM_0] [get_bd_intf_pins PL_x/S_AXI_MM_0]
connect_bd_intf_net [get_bd_intf_ports BMC_UART] [get_bd_intf_pins PL_x/BMC_UART]
connect_bd_intf_net -intf_net S00_AXI_0_1 [get_bd_intf_ports S00_AXI_0] [get_bd_intf_pins PL_x/S00_AXI]
connect_bd_intf_net [get_bd_intf_ports iiC] [get_bd_intf_pins PL_x/iiC]
connect_bd_net [get_bd_ports C0_DDR_SREF_CTRL_IN] [get_bd_pins PL_x/C0_DDR_SREF_CTRL_IN]
connect_bd_net [get_bd_ports C2_DDR_SREF_CTRL_IN] [get_bd_pins PL_x/C2_DDR_SREF_CTRL_IN]
connect_bd_net [get_bd_ports C3_DDR_SREF_CTRL_IN] [get_bd_pins PL_x/C3_DDR_SREF_CTRL_IN]
connect_bd_net [get_bd_ports INIT_CAL_DONE] [get_bd_pins PL_x/INIT_CAL_DONE]
connect_bd_net [get_bd_pins PL_x/C0_DDR_SREF_CTRL_OUT] [get_bd_ports C0_DDR_SREF_CTRL_OUT]
connect_bd_net [get_bd_pins PL_x/C2_DDR_SREF_CTRL_OUT] [get_bd_ports C2_DDR_SREF_CTRL_OUT]
connect_bd_net [get_bd_pins PL_x/C3_DDR_SREF_CTRL_OUT] [get_bd_ports C3_DDR_SREF_CTRL_OUT]
connect_bd_net [get_bd_pins PL_x/axi_reset_n_250M_out] [get_bd_ports axi_reset_n_250M_out]
connect_bd_net [get_bd_pins PL_x/c1_init_calib_complete] [get_bd_ports c1_init_calib_complete]
connect_bd_net [get_bd_pins PL_x/clk_out_125M] [get_bd_ports clk_out_125M]
connect_bd_net [get_bd_pins PL_x/clk_out_300M] [get_bd_ports clk_out_300M]
connect_bd_net [get_bd_pins PL_x/clk_out_400M] [get_bd_ports clk_out_400M]
connect_bd_net [get_bd_pins PL_x/clk_out_PROG] [get_bd_ports clk_out_PROG]
connect_bd_net -net s_axi_aresetn_0_1 [get_bd_ports s_axi_aresetn] [get_bd_pins PL_x/s_axi_aresetn]
connect_bd_net -net user_lnk_up_sd_0_1 [get_bd_ports user_lnk_up_sd] [get_bd_pins PL_x/user_lnk_up_sd]
connect_bd_net -net clk_out_250M_0_1 [get_bd_ports clk_250M] [get_bd_pins PL_x/clk_out_250M]
connect_bd_net [get_bd_ports C1_SYS_CLK] [get_bd_pins PL_x/C1_SYS_CLK]
connect_bd_net [get_bd_ports BMC_GPIO] [get_bd_pins PL_x/BMC_GPIO]
connect_bd_net -net shell_sys_rst_in_0_1 [get_bd_ports MIG_1_RST] [get_bd_pins PL_x/MIG_1_RST]

# ---- address map ----
assign_bd_address -offset 0x00010000 -range 4K -target_address_space [get_bd_addr_spaces S00_AXI_0] [get_bd_addr_segs PL_x/axi_gpio_0/S_AXI/Reg]
assign_bd_address -offset 0x00011000 -range 4K -target_address_space [get_bd_addr_spaces S00_AXI_0] [get_bd_addr_segs PL_x/axi_gpio_1/S_AXI/Reg]
assign_bd_address -offset 0x00012000 -range 4K -target_address_space [get_bd_addr_spaces S00_AXI_0] [get_bd_addr_segs PL_x/axi_gpio_2/S_AXI/Reg]
assign_bd_address -offset 0x00015000 -range 4K -target_address_space [get_bd_addr_spaces S00_AXI_0] [get_bd_addr_segs PL_x/axi_gpio_C3_SREF/S_AXI/Reg]
assign_bd_address -offset 0x00016000 -range 4K -target_address_space [get_bd_addr_spaces S00_AXI_0] [get_bd_addr_segs PL_x/axi_gpio_C0_SREF/S_AXI/Reg]
assign_bd_address -offset 0x00017000 -range 4K -target_address_space [get_bd_addr_spaces S00_AXI_0] [get_bd_addr_segs PL_x/axi_gpio_C2_SREF/S_AXI/Reg]
assign_bd_address -offset 0x00018000 -range 4K -target_address_space [get_bd_addr_spaces S00_AXI_0] [get_bd_addr_segs PL_x/DDR4_SH/axi_gpio_C1_SREF/S_AXI/Reg]
assign_bd_address -offset 0x00019000 -range 4K -target_address_space [get_bd_addr_spaces S00_AXI_0] [get_bd_addr_segs PL_x/axi_gpio_4/S_AXI/Reg]
assign_bd_address -offset 0x00020000 -range 64K -target_address_space [get_bd_addr_spaces S00_AXI_0] [get_bd_addr_segs PL_x/clk_wiz_PROG/s_axi_lite/Reg]
assign_bd_address -offset 0x00060000 -range 64K -target_address_space [get_bd_addr_spaces S00_AXI_0] [get_bd_addr_segs PL_x/DDR4_SH/ddr4_1/C0_DDR4_MEMORY_MAP_CTRL/C0_REG]
assign_bd_address -offset 0x00070000 -range 8K -target_address_space [get_bd_addr_spaces S00_AXI_0] [get_bd_addr_segs PL_x/axi_bram_ctrl_0/S_AXI/Mem0]
assign_bd_address -offset 0x00080000 -range 64K -target_address_space [get_bd_addr_spaces S00_AXI_0] [get_bd_addr_segs PL_x/axi_iic_0/S_AXI/Reg]
assign_bd_address -offset 0x000D0000 -range 4K -target_address_space [get_bd_addr_spaces S00_AXI_0] [get_bd_addr_segs PL_x/axi_gpio_EFUSE_SHELL_VER/S_AXI/Reg]
assign_bd_address -offset 0x000E0000 -range 64K -target_address_space [get_bd_addr_spaces S00_AXI_0] [get_bd_addr_segs PL_x/DDR4_SH/myip_AXIL_TO_XSDB_v1_0/s00_axi/reg0]
assign_bd_address -offset 0x00100000 -range 1M -target_address_space [get_bd_addr_spaces S00_AXI_0] [get_bd_addr_segs M_AXI_LITE_TO_HLS_PR_NORTH/Reg]
assign_bd_address -offset 0x00200000 -range 256K -target_address_space [get_bd_addr_spaces S00_AXI_0] [get_bd_addr_segs PL_x/cms_subsystem_0/s_axi_ctrl/Mem0]
assign_bd_address -offset 0x0000000000000000 -range 16G -target_address_space [get_bd_addr_spaces S_AXI_MM_0] [get_bd_addr_segs PL_x/DDR4_SH/ddr4_1/C0_DDR4_MEMORY_MAP/C0_DDR4_ADDRESS_BLOCK]

validate_bd_design
save_bd_design
